# Altium schematic sheet Supply.SchDoc
size A4; SheetNumber: 3; SheetTotal: 12; Time: Supply
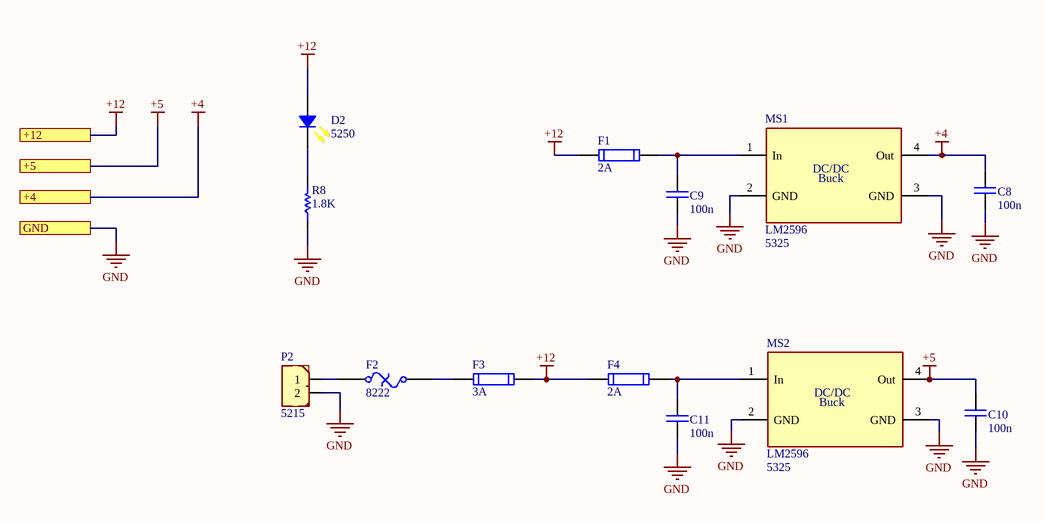
[diagram p0: Supply.SchDoc]

## Parts
C8  100n  [CAP 1206/3216]
C9  100n  [CAP 1206/3216]
C10  100n  [CAP 1206/3216]
C11  100n  [CAP 1206/3216]
D2  Inflow: 5250  [LED 1206/3216 YELLOW]  (hidden comment: Yellow, 1206)
F1  2A  [1206_F]
F2  Inflow: 8222  [PIN-W2/E2.8]  (hidden comment: 180'C, 10'A)
F3  3A  [1206_F]
F4  2A  [1206_F]
MS1  Inflow: 5325  [LM2596_modsen]  (hidden comment: LM2596)
MS2  Inflow: 5325  [LM2596_modsen]  (hidden comment: LM2596)
P2  Inflow: 5215  [645002117322]  (hidden comment: 2'Pin)
R8  1.8K  [RES 1206 (3216X08L)]

## Ports
+4, +5, +12, GND

## Nets
+4: C8.1 MS1.4(Out) ; port +4
+5: C10.1 MS2.4(Out) ; port +5
+12: D2.1 F1.1 F3.2 F4.1 ; port +12
GND: C8.2 C9.2 C10.2 C11.2 MS1.2(GND) MS1.3(GND) MS2.2(GND) MS2.3(GND) P2.2 R8.1 ; port GND
NetC9_1: C9.1 F1.2 MS1.1(In)
NetC11_1: C11.1 F4.2 MS2.1(In)
NetD2_2: D2.2 R8.2
NetF2_1: F2.1 P2.1
NetF2_2: F2.2 F3.1

## Notes on the sheet
- Title:
- Project:
- Drawn by:
- Revision:
- Hossein Bagheri
- Company:
- Sheet
- of
- (in symbol ModSen_LM2596) DC/DC; Buck

## Library data of the parts
C8-C11 = Cap_Multi_SMD_100nF_1206: Bipolar ceramic capacitor SMD; Type: MultiLayer; Inflow: inflow?; Rating: 50V; Validation: Valid; Package: 1206; Value: 100n
D2 = Semi_LED_Yellow_1206: LED; Rating: Rating?; Type: Type?; Validation: Valid; Value: Yellow, 1206; Package: Package?
F1 F3 F4 = Other_Elec_Fuse_SMD: Short circiut  protection; Inflow: inflow?; Type: Fast; Rating: Rating?; Validation: Valid; Package: 1206
  F1 F4: Value: 2A
  F3: Value: 3A
F2 = Other_Elec_Fuse_Thermal: Thermal Fuse; Rating: Rating?; Type: Type?; Validation: NT; Value: 180'C, 10'A; Package: Package?
MS1 MS2 = ModSen_LM2596: DC to DC Buck converter 1.23V-30V 3A; Rating: Rating?; Validation: Valid; Package: Package?; Type: Type?; Value: LM2596
P2 = Con_Power_2_PC_H: 2'Pin Power Connector; Rating: Rating?; Validation: Valid; Value: 2'Pin; Package: Package?; Type: Type?
R8 = Res_SMD_1206: Resistor; Inflow: inflow?; Rating: 0.25W; Validation: Valid; Package: 1206; Type: 10%; Value: 1.8K